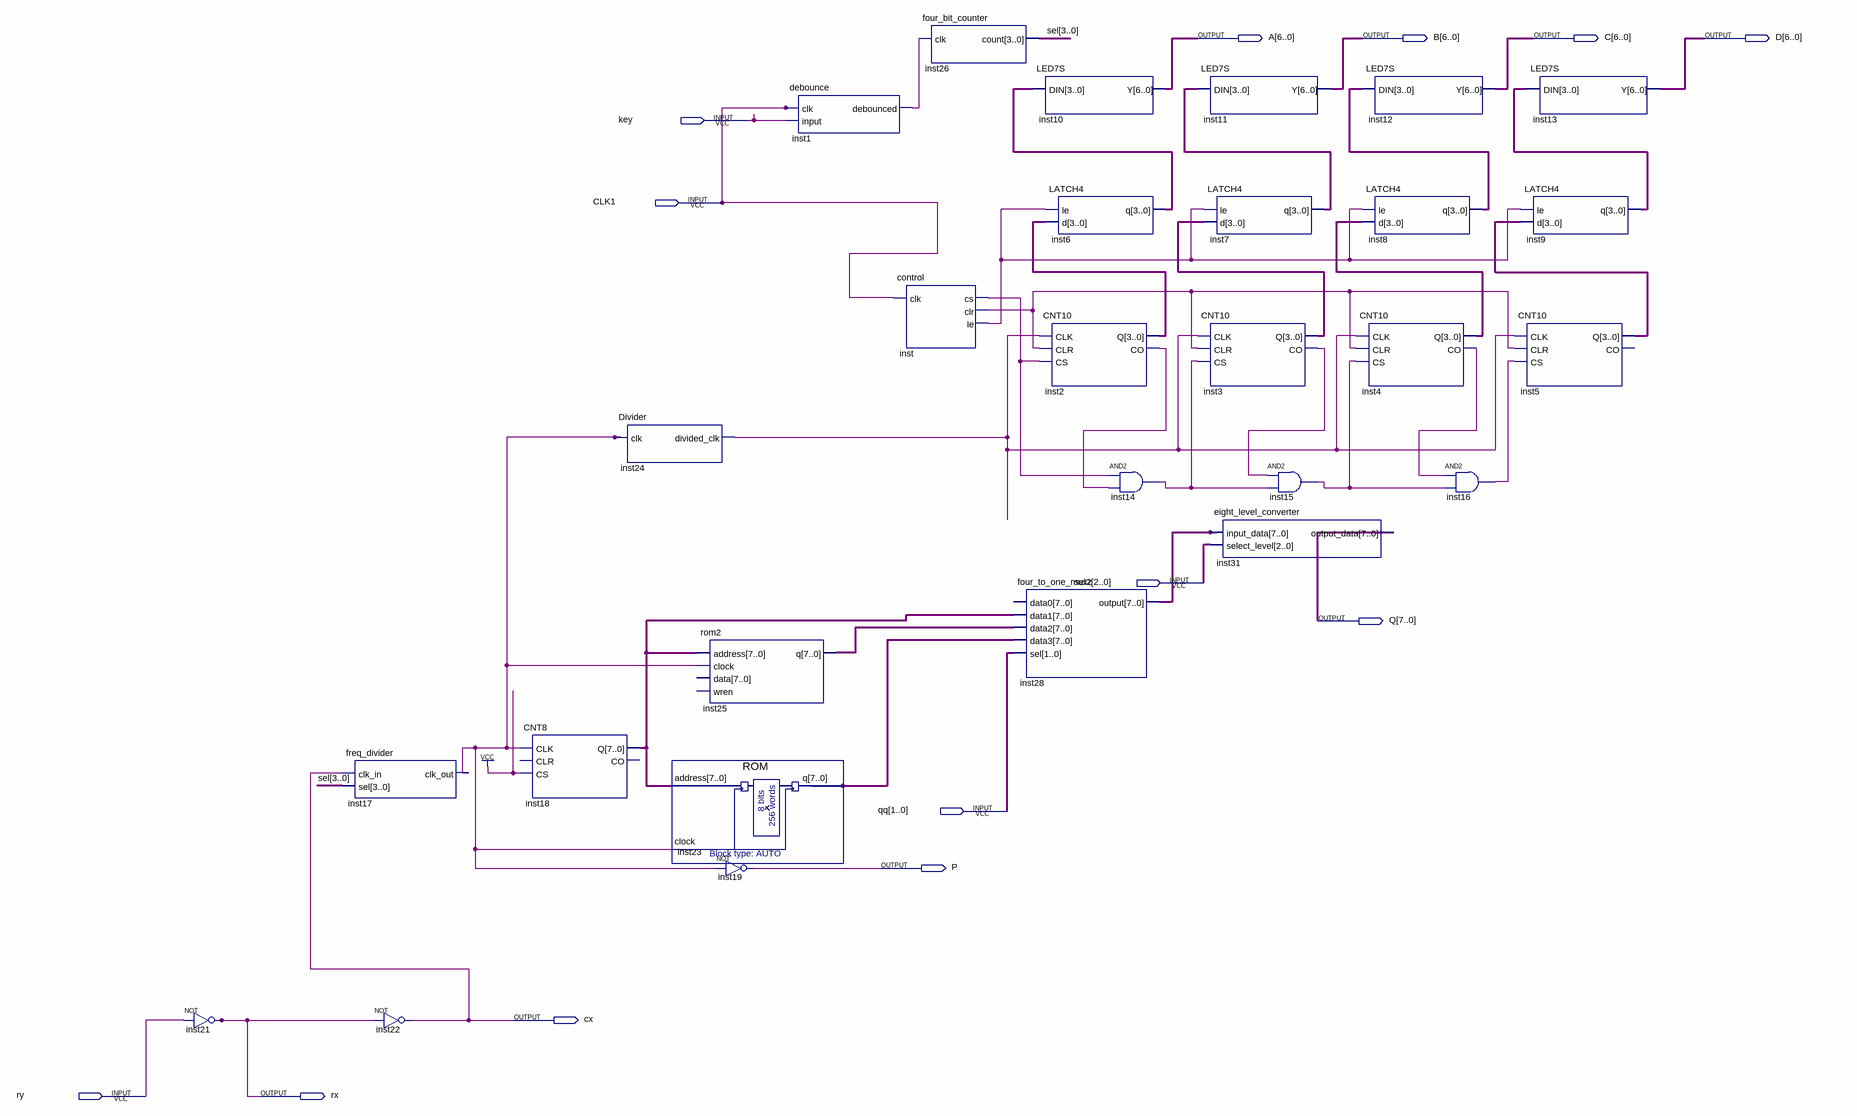
[diagram p0: schematic sheet]
// Quartus schematic FMETER.bdf as structural Verilog: 28 symbols, 13 pins
module FMETER (
  input  key,
  input  CLK1,
  input  [2:0] sel2,
  input  [1:0] qq,
  input  ry,
  output [6:0] A,
  output [6:0] B,
  output [6:0] C,
  output [6:0] D,
  output [7:0] Q,
  output P,
  output cx,
  output rx
);

  wire inst1_debounced, inst2_co, inst3_co, inst4_co, inst14_out, inst15_out, inst16_out, inst17_clk_out,
       inst24_divided_clk, inst_clr, inst_cs, inst_le;
  wire [3:0] inst2_q, inst3_q, inst4_q, inst5_q, inst6_q, inst7_q, inst8_q, inst9_q, sel;
  wire [7:0] inst18_q, inst23_q, inst25_q, inst28_output;

  not inst21 (rx, ry);
  freq_divider inst17 (.clk_in(cx), .sel(sel), .clk_out(inst17_clk_out));
  not inst22 (cx, rx);
  CNT8 inst18 (.CLK(inst17_clk_out), .CS(1'b1), .Q(inst18_q));  // open: CLR, CO
  Divider inst24 (.clk(inst17_clk_out), .divided_clk(inst24_divided_clk));
  rom2 inst25 (.address(inst18_q), .clock(inst17_clk_out), .q(inst25_q));  // open: data, wren
  ROM inst23 (.address(inst18_q), .clock(inst17_clk_out), .q(inst23_q));
  not inst19 (P, inst17_clk_out);
  debounce inst1 (.clk(CLK1), .\input (key), .debounced(inst1_debounced));
  control inst (.clk(CLK1), .cs(inst_cs), .clr(inst_clr), .le(inst_le));
  four_bit_counter inst26 (.clk(inst1_debounced), .count(sel));
  four_to_one_muxz inst28 (
    .data1(inst18_q), .data2(inst25_q), .data3(inst23_q), .sel(qq), .\output (inst28_output));  // open: data0
  LED7S inst10 (.DIN(inst6_q), .Y(A));
  LATCH4 inst6 (.le(inst_le), .d(inst2_q), .q(inst6_q));
  CNT10 inst2 (.CLK(inst24_divided_clk), .CLR(inst_clr), .CS(inst_cs), .Q(inst2_q), .CO(inst2_co));
  and inst14 (inst14_out, inst_cs, inst2_co);
  LED7S inst11 (.DIN(inst7_q), .Y(B));
  LATCH4 inst7 (.le(inst_le), .d(inst3_q), .q(inst7_q));
  CNT10 inst3 (.CLK(inst24_divided_clk), .CLR(inst_clr), .CS(inst14_out), .Q(inst3_q), .CO(inst3_co));
  eight_level_converter inst31 (.input_data(inst28_output), .select_level(sel2), .output_data(Q));
  and inst15 (inst15_out, inst3_co, inst14_out);
  LED7S inst12 (.DIN(inst8_q), .Y(C));
  LATCH4 inst8 (.le(inst_le), .d(inst4_q), .q(inst8_q));
  CNT10 inst4 (.CLK(inst24_divided_clk), .CLR(inst_clr), .CS(inst15_out), .Q(inst4_q), .CO(inst4_co));
  and inst16 (inst16_out, inst4_co, inst15_out);
  LATCH4 inst9 (.le(inst_le), .d(inst5_q), .q(inst9_q));
  CNT10 inst5 (.CLK(inst24_divided_clk), .CLR(inst_clr), .CS(inst16_out), .Q(inst5_q));  // open: CO
  LED7S inst13 (.DIN(inst9_q), .Y(D));
endmodule
